# Altium schematic sheet POWER.SchDoc
size A3; SheetNumber: 6; SheetTotal: 13
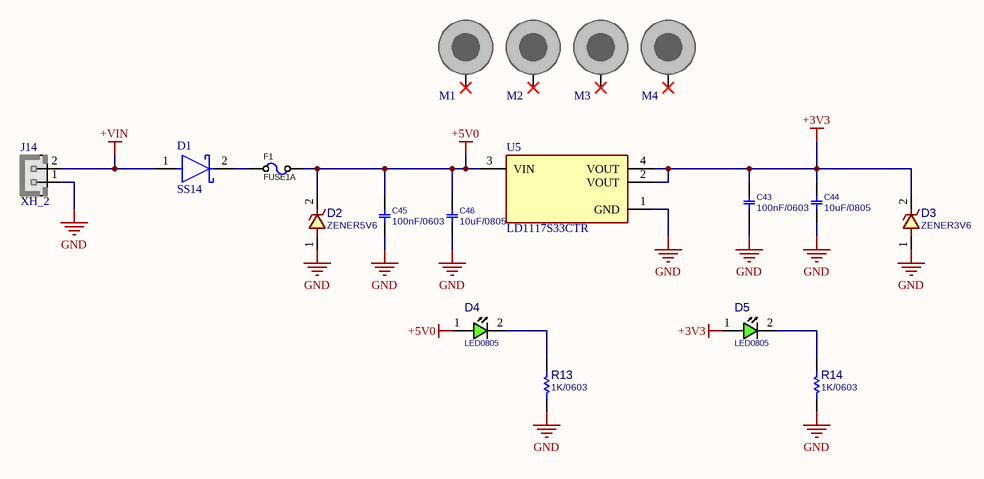
[diagram p0: POWER.SchDoc]

## Parts
?  (no value)  (graphical)
C43  100nF/0603  [C0603]
C44  10uF/0805  [C0805]
C45  100nF/0603  [C0603]
C46  10uF/0805  [C0805]
D1  SS14  [FP-403AE-MFG]
D2  ZENER5V6  [D_SOD123W]
D3  ZENER3V6  [D_SOD123W]
D4  LED0805  [LED0805]
D5  LED0805  [LED0805]
F1  FUSE1A  [F1206]
J14  XH_2  [XH_2]
M1  DNP/MH  [SCMH_M3FT]  (value not drawn)  (no BOM)
M2  DNP/MH  [SCMH_M3FT]  (value not drawn)  (no BOM)
M3  DNP/MH  [SCMH_M3FT]  (value not drawn)  (no BOM)
M4  DNP/MH  [SCMH_M3FT]  (value not drawn)  (no BOM)
R13  1K/0603  [R0603]
R14  1K/0603  [R0603]
U5  LD1117S33CTR  [FP-SOT-223-0046067_14-MFG]

## Nets
+3V3: C43.2 C44.2 D3.2 D5.1(ANODE) U5.2(VOUT) U5.4(VOUT)
+5V0: C45.2 C46.2 D2.2 D4.1(ANODE) F1.2 U5.3(VIN)
+VIN: D1.1(A) J14.2
GND: C43.1 C44.1 C45.1 C46.1 D2.1 D3.1 J14.1 R13.1 R14.1 U5.1(GND)
NetD1_2: D1.2(C) F1.1
NetD4_2: D4.2(CATHODE) R13.2
NetD5_2: D5.2(CATHODE) R14.2

Not connected (* = marked no-connect by the designer): M1 1*; M2 1*; M3 1*; M4 1*

## Notes on the sheet
- Title:
- Page Contents:
- Variant:
- Checked by
- Size:
- Date:
- DWG NO
- Sheet
- of
- Revision:

## Library data of the parts
? = SDTitleBlock
C43 C45 = CAP_SMD_MLCC_0603: CAP, MLCC; PARAM: -, -%; MANF_P#: MANF_PART#; PARAM2: -V; PRICE: 100= 1$; MANF: -; ASSEMBLY: ASSEMBLY; VALUE: 100nF/0603
C44 C46 = CAP_SMD_MLCC: CAP, MLCC; PARAM: C0G, 10%; DESC: CAP, MLCC, 1nF, 50V, C0G, 10%, 0402; MANF_P#: MANF_PART#; MANF: Murata; PARAM2: 50V; PRICE: 100= 1$; ASSEMBLY: ASSEMBLY; VALUE: 10uF/0805
D1 = CMP-2000-04943-2: DIODE SCHOTTKY 40V 1A SMA; Manufacturer: ON Semiconductor; Peak Reverse Current: 0.2mA; Max Junction Temp: +125°C; Standoff Height: 0.05mm; Max Surge Forward Current: 40A; Mouser Description: Schottky Diodes & Rectifiers SMA 40V 1.0A; RoHS: TRUE; Lead Free: Yes; Manufacturer Part Number: SS14; Device Class L3: Schottky Diodes; Category: Diode; Automotive: No; Digikey Description: DIODE SCHOTTKY 40V 1A SMA; ComponentLink2Description: Datasheet; Device Class L2: Diodes; Height: 2.5mm; Temperature Range High: +125°C; ComponentLink2URL: https://www.onsemi.com/pub/Collateral/SS19-D.PDF; Device Class L1: Discrete Semiconductors; Package: 403AE; Octopart: https://octopart.com/ss14-on+semiconductor-29205033; Max Repetitive Reverse Voltage: 40V; Temperature Range Low: -65°C; Forward Current: 1A; Temperature: -65°C to +125°C
D2 D3 = DIODE_SMD_ZENER_DFLZ5V6: DIODE, ZENER, 1W, 5.1V; MANF: Diodes; DESC: DESCRIPTION; PARAM2: 1W, 4Ohm, -55~150oC; PARAM: 5.6V; MANF_P#: DFLZ5V6-7; ASSEMBLY: ASSEMBLY; PRICE: 0.5$
  D2: VALUE: ZENER5V6
  D3: VALUE: ZENER3V6
D4 D5 = LED_SMD_0805: LED, SMD, 0805; DESC: DESCRIPTION; MANF_P#: MANF_PART#; PARAM2: 2.2V; MANF: MANF; ASSEMBLY: ASSEMBLY; PRICE: PRICE; VALUE: LED0805
F1 = FUSE_160mA_1206: Fuse, 160mA, 63VDC, 1206, SMD, Fast Acting; PARAM: 160mA; 63VDC; slow-blow; MANF: Holly Fuse; MANF_P#: 12T-0160L; PARAM2: PARAM2; VALUE: FUSE1A
J14 = XH_2: PW10-x-M, JST-BxB-XH-A pitch: 2.5mm, 3A/250v; MANF: JST; MANF_P#: B2B-XH-A; PARAM2: 250v; PARAM: 3.0A; VALUE: XH_2
M1-M4 = SCMH_M3FT: SCREW mouting, M3, 3.0mm diameter and 6.0mm, FlatHead; ASSEMBLY: DNP; VALUE: DNP/MH
R13 R14 = RES_SMD_0603: RESISTOR, SMD; PARAM: 1%, 0.1W; DESC: DESCRIPTION; DIST#: MOUSER; MANF_P#: -; MANF: -; ASSEMBLY: ASSEMBLY; PRICE: -; PARAM2: -; VALUE: 1K/0603
U5 = CMP-0244-00307-2: IC REG LINEAR 3.3V 800MA SOT223; Input Bias Current: 5mA; Output Voltage Accuracy: 1%; Dropout Voltage: 1.1V; Power Dissipation: 12W; Polarity: Positive; Min Input Voltage: 5.3V; Quiescent Current: 10mA; Max Output Current: 1.3A; Output Current: 950mA; Number of Regulators: 1; Max Supply Voltage: 15V; Output Type: Fixed; Output Voltage: 3.3V; Number of Terminals: 4; Min Supply Voltage: 3.3V; Termination: SMD/SMT; Mount: Surface Mount; Max Power Dissipation: 12W; Case/Package: SOT-223; Lead Free: Lead Free; Height: 1.8mm; REACH SVHC: No SVHC; Radiation Hardening: No; Width: 3.5mm; Length: 6.5mm; Packaging: Tape and Reel; Max Input Voltage: 15V; Accuracy: 1%; Weight: 0.01lb; Contact Plating: Tin; Max Operating Temperature: 125°C; Number of Pins: 4; Max Output Voltage: 3.3V; Min Operating Temperature: -40°C; Nominal Output Voltage: 3.3V; Package Quantity: 1; Min Output Voltage: 3.3V; Number of Outputs: 1